# Altium project modFOC.PrjPcb
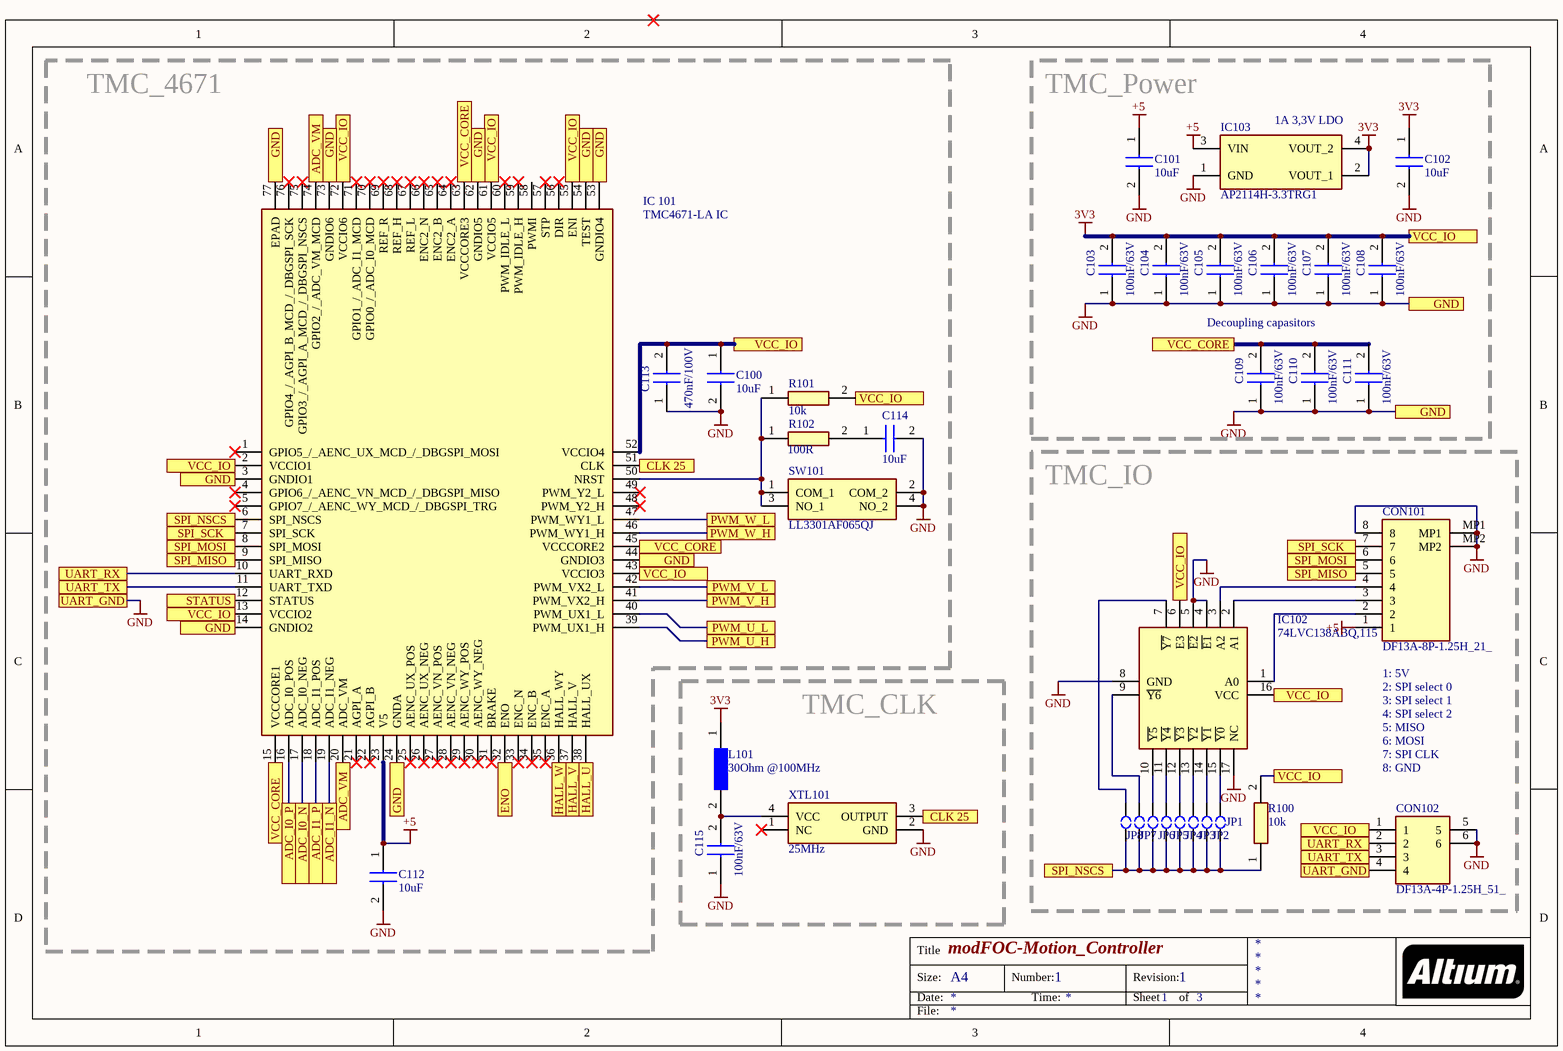
[diagram p0: modFOC-Motion_Controller.SchDoc]
3 sheets, 101 parts. Net scope: flat (ports and power ports of the same name join across sheets).
Board file: modFOC_ESC.PcbDoc
Sheets:
  modFOC-Motion_Controller.SchDoc
  modFOC-Sensing.SchDoc
  modFOC-Powerstage.SchDoc

## Sheet modFOC-Motion_Controller.SchDoc: modFOC-Motion_Controller
size A4; Date: dssd; DocumentNumber: 1; Revision: 1; SheetNumber: 1; SheetTotal: 3

### Parts
C100  10uF  [CAPC3225X280N]
C101  10uF  [CAPC3225X280N]
C102  10uF  [CAPC3225X280N]
C103  100nF/63V  [CAPC1608X97N]
C104  100nF/63V  [CAPC1608X97N]
C105  100nF/63V  [CAPC1608X97N]
C106  100nF/63V  [CAPC1608X97N]
C107  100nF/63V  [CAPC1608X97N]
C108  100nF/63V  [CAPC1608X97N]
C109  100nF/63V  [CAPC1608X97N]
C110  100nF/63V  [CAPC1608X97N]
C111  100nF/63V  [CAPC1608X97N]
C112  10uF  [CAPC3225X280N]
C113  470nF/100V  [CAPC2012X140N]
C114  10uF  [CAPC3225X280N]
C115  100nF/63V  [CAPC1608X97N]
CON101  DF13A-8P-1.25H_21_  [DF13A8P125H21]
CON102  DF13A-4P-1.25H_51_  [DF13A4P125H51]
IC102  74LVC138ABQ,115  [74HCT595BQ115]
IC103  AP2114H-3.3TRG1  [SOT230P700X180-4N]
IC_101  TMC4671-LA IC  [QFN40P1050X650X90-77N]
JP1  SolderJumper  [SolderJmp_0.8mm]  (value not drawn)
JP2  SolderJumper  [SolderJmp_0.8mm]  (value not drawn)
JP3  SolderJumper  [SolderJmp_0.8mm]  (value not drawn)
JP4  SolderJumper  [SolderJmp_0.8mm]  (value not drawn)
JP5  SolderJumper  [SolderJmp_0.8mm]  (value not drawn)
JP6  SolderJumper  [SolderJmp_0.8mm]  (value not drawn)
JP7  SolderJumper  [SolderJmp_0.8mm]  (value not drawn)
JP8  SolderJumper  [SolderJmp_0.8mm]  (value not drawn)
L101  30Ohm @100MHz  [BLM18KG101TH1D]
R100  10k  [RESC1608X55N]
R101  10k  [RESC1608X55N]
R102  100R  [RESC1608X55N]
SW101  LL3301AF065QJ  [LL3301FF065QJ]
XTL101  25MHz  [FOX924B25]

### Blocks framed on the sheet
TMC_4671: C100 C112-C114 IC_101 R101 R102 SW101
TMC_Power: C101-C111 IC103
TMC_IO: CON101 CON102 IC102 JP1-JP8 R100
TMC_CLK: C115 L101 XTL101

### Ports
ADC_I0_N, ADC_I0_P, ADC_I1_N, ADC_I1_P, ADC_VM, CLK 25, ENO, GND, HALL_U, HALL_V, HALL_W, PWM_U_H, PWM_U_L, PWM_V_H, PWM_V_L, PWM_W_H, PWM_W_L, SPI_MISO, SPI_MOSI, SPI_NSCS, SPI_SCK, STATUS, UART_GND, UART_RX, UART_TX, VCC_CORE, VCC_IO

### Nets
3V3: C100.1 C102.1 C103.2 C104.2 C105.2 C106.2 C107.2 C108.2 C113.2 CON102.1 IC102.6(E3) IC102.16(VCC) IC103.2(VOUT_1) IC103.4(VOUT_2) IC_101.2(VCCIO1) IC_101.13(VCCIO2) IC_101.43(VCCIO3) IC_101.52(VCCIO4) IC_101.55(ENI) IC_101.61(VCCIO5) IC_101.72(VCCIO6) L101.1 R100.2 R101.2 ; port VCC_IO
+5: C101.1 C112.1 CON101.1 IC103.3(VIN) IC_101.23(V5)
GND: C100.2 C101.2 C102.2 C103.1 C104.1 C105.1 C106.1 C107.1 C108.1 C109.1 C110.1 C111.1 C112.2 C113.1 C114.2 C115.1 CON101.8 CON101.MP1 CON101.MP2 CON102.4 CON102.5 CON102.6 IC102.4(~{E1}) IC102.5(~{E2}) IC102.8(GND) IC102.17(NC) IC103.1(GND) IC_101.3(GNDIO1) IC_101.14(GNDIO2) IC_101.24(GNDA) IC_101.44(GNDIO3) IC_101.53(GNDIO4) IC_101.54(TEST) IC_101.62(GNDIO5) IC_101.73(GNDIO6) IC_101.77(EPAD) SW101.2(COM_2) SW101.4(NO_2) XTL101.2(GND) ; port GND, port UART_GND
NetC109_2: C109.2 C110.2 C111.2 IC_101.15(VCCCORE1) IC_101.45(VCCCORE2) IC_101.63(VCCCORE3) ; port VCC_CORE
NetC114_1: C114.1 R102.2
NetC115_2: C115.2 L101.2 XTL101.4(VCC)
NetC204_2: IC_101.16(ADC_I0_POS) ; port ADC_I0_P
NetC205_2: IC_101.20(ADC_VM) IC_101.74(GPIO2_/_ADC_VM_MCD) ; port ADC_VM
NetC206_2: IC_101.18(ADC_I1_POS) ; port ADC_I1_P
NetCON101_2: CON101.2 IC102.1(A0)
NetCON101_3: CON101.3 IC102.2(A1)
NetCON101_4: CON101.4 IC102.3(A2)
NetCON101_5: CON101.5 IC_101.9(SPI_MISO) ; port SPI_MISO
NetCON101_6: CON101.6 IC_101.8(SPI_MOSI) ; port SPI_MOSI
NetCON101_7: CON101.7 IC_101.7(SPI_SCK) ; port SPI_SCK
NetCON102_2: CON102.2 IC_101.10(UART_RXD) ; port UART_RX
NetCON102_3: CON102.3 IC_101.11(UART_TXD) ; port UART_TX
NetIC102_7: IC102.7(~{Y7}) JP8.2
NetIC102_9: IC102.9(~{Y6}) JP7.2
NetIC102_10: IC102.10(~{Y5}) JP6.2
NetIC102_11: IC102.11(~{Y4}) JP5.2
NetIC102_12: IC102.12(~{Y3}) JP4.2
NetIC102_13: IC102.13(~{Y2}) JP3.2
NetIC102_14: IC102.14(~{Y1}) JP2.2
NetIC102_15: IC102.15(~{Y0}) JP1.2
NetIC200_2: IC_101.38(HALL_UX) ; port HALL_U
NetIC200_5: IC_101.37(HALL_V) ; port HALL_V
NetIC200_7: IC_101.36(HALL_WY) ; port HALL_W
NetIC300_34: IC_101.46(PWM_WY1_H) ; port PWM_W_H
NetIC300_35: IC_101.47(PWM_WY1_L) ; port PWM_W_L
NetIC300_36: IC_101.41(PWM_VX2_H) ; port PWM_V_H
NetIC300_37: IC_101.42(PWM_VX2_L) ; port PWM_V_L
NetIC300_38: IC_101.39(PWM_UX1_H) ; port PWM_U_H
NetIC300_39: IC_101.40(PWM_UX1_L) ; port PWM_U_L
NetIC_101_6: IC_101.6(SPI_NSCS) JP1.1 JP2.1 JP3.1 JP4.1 JP5.1 JP6.1 JP7.1 JP8.1 R100.1 ; port SPI_NSCS
NetIC_101_12: IC_101.12(STATUS) ; port STATUS
NetIC_101_17: IC_101.17(ADC_I0_NEG) ; port ADC_I0_N
NetIC_101_19: IC_101.19(ADC_I1_NEG) ; port ADC_I1_N
NetIC_101_32: IC_101.32(ENO) ; port ENO
NetIC_101_50: IC_101.50(NRST) R101.1 R102.1 SW101.1(COM_1) SW101.3(NO_1)
NetIC_101_51: IC_101.51(CLK) XTL101.3(OUTPUT) ; port CLK 25

Not connected (* = marked no-connect by the designer): IC_101 1(GPIO5_/_AENC_UX_MCD_/_DBGSPI_MOSI)* 4(GPIO6_/_AENC_VN_MCD_/_DBGSPI_MISO)* 5(GPIO7_/_AENC_WY_MCD_/_DBGSPI_TRG)* 21(AGPI_A)* 22(AGPI_B)* 25(AENC_UX_POS)* 26(AENC_UX_NEG)* 27(AENC_VN_POS)* 28(AENC_VN_NEG)* 29(AENC_WY_POS)* 30(AENC_WY_NEG)* 31(BRAKE)* 33(ENC_N)* 34(ENC_B)* 35(ENC_A)* 48(PWM_Y2_H)* 49(PWM_Y2_L)* 56(DIR)* 57(STP)* 58(PWMI) 59(PWM_IDLE_H)* 60(PWM_IDLE_L)* 64(ENC2_A)* 65(ENC2_B)* 66(ENC2_N)* 67(REF_L)* 68(REF_H)* 69(REF_R)* 70(GPIO0_/_ADC_I0_MCD)* 71(GPIO1_/_ADC_I1_MCD)* 75(GPIO3_/_AGPI_A_MCD_/_DBGSPI_NSCS)* 76(GPIO4_/_AGPI_B_MCD_/_DBGSPI_SCK)*; XTL101 1(NC)*

### Notes on the sheet
- (near IC103) 1A 3,3V LDO
- Decoupling capasitors
- (near CON101) 1: 5V
- 2: SPI select 0
- 3: SPI select 1
- 4: SPI select 2
- 5: MISO
- 6: MOSI
- 7: SPI CLK
- 8: GND
- Title
- Size:
- Date:
- A4
- Number:
- Time:
- Revision:
- Sheet
- of
- File:

### Library data of the parts
C100-C102 C112 C114 = CL32B106KMVNNWE: Capacitor; Manufacturer_Name: Samsung Electro-Mechanics; Datasheet Link: https://www.arrow.com/en/products/cl32b106kmvnnwe/samsung-electro-mechanics; Height: 2.8mm; Manufacturer_Part_Number: CL32B106KMVNNWE; Arrow Part Number: CL32B106KMVNNWE; Arrow Price/Stock: https://www.arrow.com/en/products/cl32b106kmvnnwe/samsung-electro-mechanics; Mouser Part Number: 187-CL32B106KMVNNWE; Mouser Price/Stock: https://www.mouser.co.uk/ProductDetail/Samsung-Electro-Mechanics/CL32B106KMVNNWE?qs=xZ%2FP%252Ba9zWqaEMBbSgKy8gQ%3D%3D
C103-C111 C115 = C0805C104MMREC7210: Capacitor; Manufacturer_Name: Vishay; Manufacturer_Part_Number: VJ0603Y104JXJAC; Datasheet Link: http://www.vishay.com/docs/45226/vj31xrohsautomlcc.pdf; Height: 1mm; Mouser Part Number: 77-VJ0603Y104JXJAC; Mouser Price/Stock: https://www.mouser.com/Search/Refine.aspx?Keyword=77-VJ0603Y104JXJAC
C113 = 08051C474KAT2A: Capacitor; Manufacturer_Name: AVX; Datasheet Link: http://datasheets.avx.com/X7RDielectric.pdf; Height: 1.4mm; Manufacturer_Part_Number: 08051C474KAT2A; Mouser Part Number: 581-08051C474KAT2A; Mouser Price/Stock: https://www.mouser.co.uk/ProductDetail/AVX/08051C474KAT2A?qs=%2FjdEcI0p95Mz%2FN5KbrGN6Q%3D%3D
CON101 = DF13A-8P-1.25H_21_: Connector; Manufacturer_Name: Hirose; Manufacturer_Part_Number: DF13A-8P-1.25H(21); Datasheet Link: http://uk.rs-online.com/web/p/products/7793617P; Height: 3.6mm; Mouser Part Number: 798-DF13A8P125H21; Mouser Price/Stock: https://www.mouser.co.uk/ProductDetail/Hirose-Connector/DF13A-8P-125H21?qs=XQjbzJWzFPViW0MGk5%2FVbA%3D%3D
CON102 = DF13A-4P-1.25H_51_: Connector; Manufacturer_Name: Hirose; Manufacturer_Part_Number: DF13A-4P-1.25H(51); Datasheet Link: https://www.hirose.com/product/en/products/DF13/DF13A-4P-1.25H%2851%29/; Height: 3mm; Mouser Part Number: 798-DF13A4P125H51; Mouser Price/Stock: https://www.mouser.co.uk/ProductDetail/Hirose-Connector/DF13A-4P-125H51?qs=XQjbzJWzFPVR%252B%2FH2vthd9w%3D%3D
IC102 = 74LVC138ABQ,115: Integrated Circuit; Manufacturer_Name: Nexperia; Datasheet Link: https://assets.nexperia.com/documents/data-sheet/74LVC138A.pdf; Manufacturer_Part_Number: 74LVC138ABQ,115; Arrow Part Number: 74LVC138ABQ,115; Arrow Price/Stock: https://www.arrow.com/en/products/74lvc138abq115/nexperia; Mouser Part Number: 771-LVC138ABQ115; Mouser Price/Stock: https://www.mouser.co.uk/ProductDetail/Nexperia/74LVC138ABQ115?qs=me8TqzrmIYUqHGpwzmLq4w%3D%3D
IC103 = AP2114H-3.3TRG1: Integrated Circuit; Manufacturer_Name: Diodes Inc.; Datasheet Link: http://uk.rs-online.com/web/p/products/8283528; Height: 1.8mm; Manufacturer_Part_Number: AP2114H-3.3TRG1; Arrow Part Number: AP2114H-3.3TRG1; Arrow Price/Stock: https://www.arrow.com/en/products/ap2114h-3.3trg1/diodes-incorporated; Mouser Part Number: 621-AP2114H-3.3TRG1; Mouser Price/Stock: https://www.mouser.co.uk/ProductDetail/Diodes-Incorporated/AP2114H-33TRG1?qs=x6A8l6qLYDDSG%2FfwzcsOhw%3D%3D
IC_101 = TMC4671-LA IC: Integrated Circuit
L101 = BLM18KG300TH1D: Ferrite Bead; Manufacturer_Name: Murata Electronics; Datasheet Link: https://www.murata.com/en-us/products/productdetail?partno=BLM18KG300TH1%23; Height: 0.75mm; Manufacturer_Part_Number: BLM18KG300TH1D; Arrow Part Number: BLM18KG300TH1D; Arrow Price/Stock: https://www.arrow.com/en/products/blm18kg300th1d/murata-manufacturing; Mouser Part Number: 81-BLM18KG300TH1D; Mouser Price/Stock: https://www.mouser.com/Search/Refine.aspx?Keyword=81-BLM18KG300TH1D
R100 R101 = RC0603FR-0710KL: Resistor; Manufacturer_Name: YAGEO (PHYCOMP); Datasheet Link: http://www.yageo.com/documents/recent/PYu-RC0603_51_RoHS_L_v5.pdf; Height: 0.55mm; Manufacturer_Part_Number: RC0603FR-0710KL; Arrow Part Number: RC0603FR-0710KL; Arrow Price/Stock: https://www.arrow.com/en/products/rc0603fr-0710kl/yageo; Mouser Part Number: 603-RC0603FR-0710KL; Mouser Price/Stock: https://www.mouser.co.uk/ProductDetail/Yageo/RC0603FR-0710KL?qs=grNVn54RoB%252B3GtjbJj3wJQ%3D%3D
R102 = CRCW0603100RFKEAC: Resistor; Manufacturer_Name: Vishay; Datasheet Link: https://componentsearchengine.com/Datasheets/1/CRCW0603100RFKEAC.pdf; Height: 0.55mm; Manufacturer_Part_Number: CRCW0603100RFKEAC; Mouser Part Number: 71-CRCW0603100RFKEAC; Mouser Price/Stock: https://www.mouser.co.uk/ProductDetail/Vishay-Dale/CRCW0603100RFKEAC/?qs=E3Y5ESvWgWPJqb4%2F19sAKw%3D%3D; Arrow Part Number: CRCW0603100RFKEAC; Arrow Price/Stock: https://www.arrow.com/en/products/crcw0603100rfkeac/vishay
SW101 = LL3301AF065QJ: Switch; Manufacturer_Name: E-Switch; Datasheet Link: https://media.digikey.com/pdf/Data%20Sheets/E-Switch%20PDFs/LL3301AF065QJ.pdf; Height: 7.3mm; Manufacturer_Part_Number: LL3301AF065QJ; Mouser Part Number: 612-LL3301AF065QJ; Mouser Price/Stock: https://www.mouser.co.uk/ProductDetail/E-Switch/LL3301AF065QJ?qs=QtyuwXswaQi68RkbBY57jQ%3D%3D
XTL101 = FOX924B-25: 25Mhz Oscillator

## Sheet modFOC-Sensing.SchDoc
size A4; DocumentNumber: 2; SheetNumber: 2; SheetTotal: 3
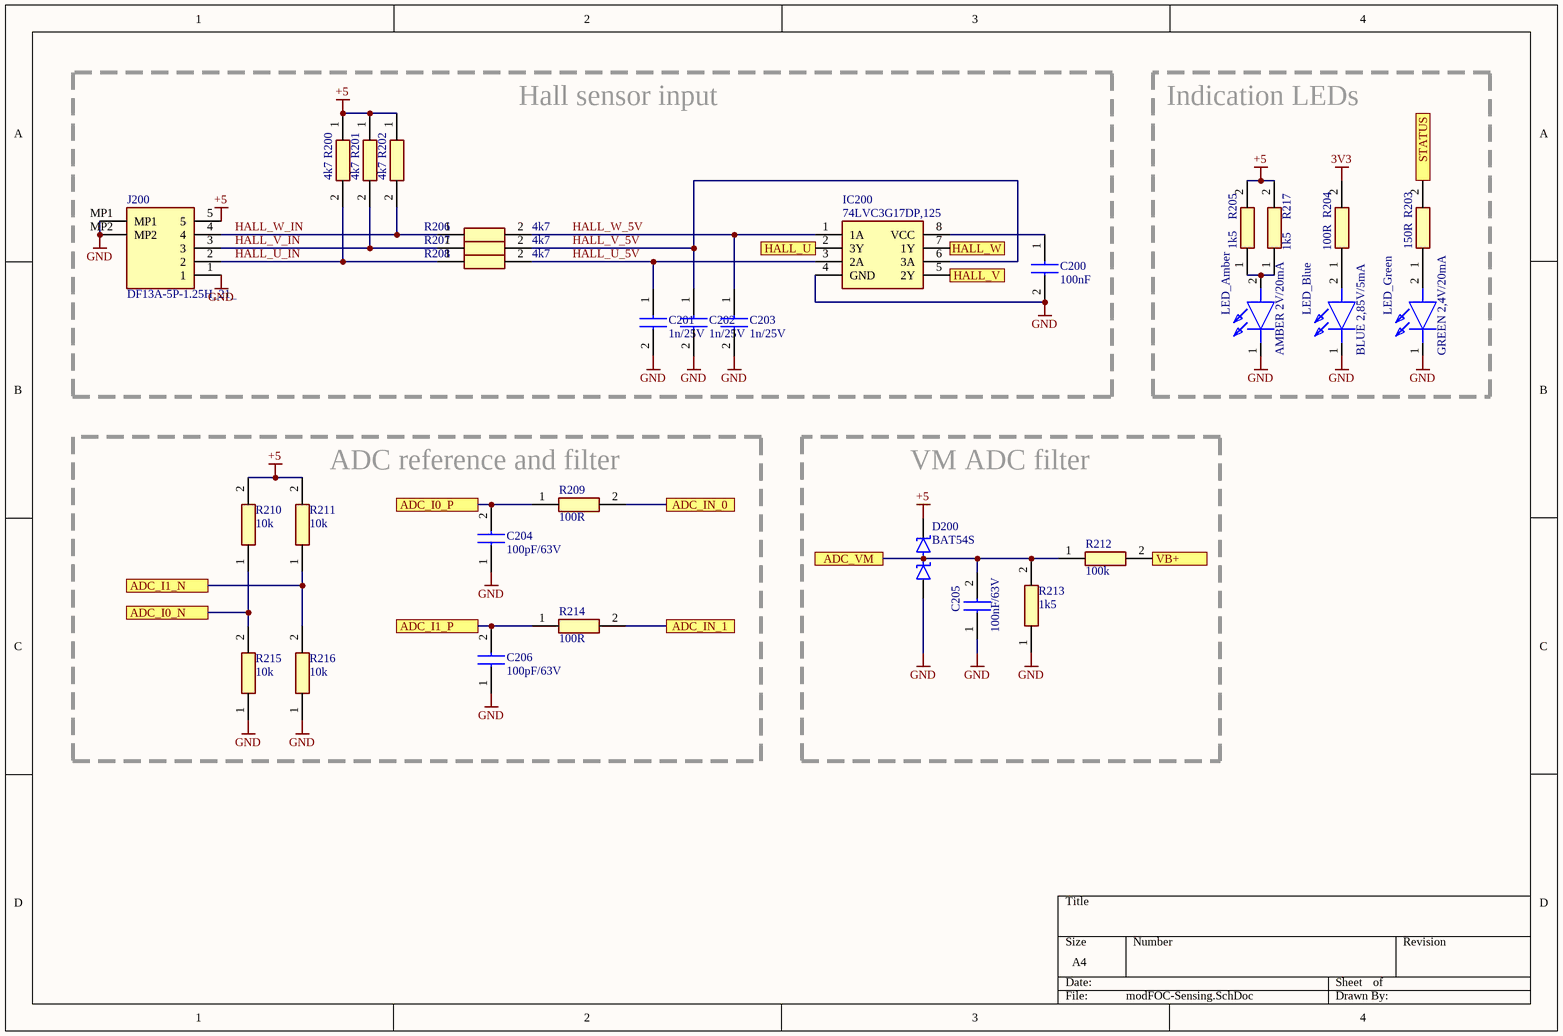
[diagram p1: modFOC-Sensing.SchDoc]

### Parts
C200  100nF  [CAPC1608X97N]
C201  1n/25V  [CAPC1608X97N]
C202  1n/25V  [CAPC1608X97N]
C203  1n/25V  [CAPC1608X97N]
C204  100pF/63V  [CAPC1608X87N]
C205  100nF/63V  [CAPC1608X97N]
C206  100pF/63V  [CAPC1608X87N]
D200  BAT54S  [SOT95P240X110-3N]
IC200  74LVC3G17DP,125  [SOP65P400X110-8N]
J200  DF13A-5P-1.25H_21_  [DF13A5P125H21]
LED_Amber  AMBER 2V/20mA  [LEDC1608X55N]
LED_Blue  BLUE 2,85V/5mA  [LEDC1608X40N]
LED_Green  GREEN 2,4V/20mA  [LGQ396PS35]
R200  4k7  [RESC1608X55N]
R201  4k7  [RESC1608X55N]
R202  4k7  [RESC1608X55N]
R203  150R  [RESC1608X55N]
R204  100R  [RESC1608X55N]
R205  1k5  [RESC1608X55N]
R206  4k7  [RESC1608X55N]
R207  4k7  [RESC1608X55N]
R208  4k7  [RESC1608X55N]
R209  100R  [RESC1608X55N]
R210  10k  [RESC1608X55N]
R211  10k  [RESC1608X55N]
R212  100k  [RESC1608X55N]
R213  1k5  [RESC1608X55N]
R214  100R  [RESC1608X55N]
R215  10k  [RESC1608X55N]
R216  10k  [RESC1608X55N]
R217  1k5  [RESC1608X55N]

### Blocks framed on the sheet
Hall sensor input: C200-C203 IC200 J200 R200-R202 R206-R208
Indication LEDs: LED_Amber LED_Blue LED_Green R203-R205 R217
ADC reference and filter: C204 C206 R209-R211 R214-R216
VM ADC filter: C205 D200 R212 R213

### Ports
ADC_I0_N, ADC_I0_P, ADC_I1_N, ADC_I1_P, ADC_IN_0, ADC_IN_1, ADC_VM, HALL_U, HALL_V, HALL_W, STATUS, VB+

### Nets
3V3: R204.2
+5: D200.2(K) J200.5 R200.1 R201.1 R202.1 R205.2 R210.2 R211.2 R217.2
GND: C200.2 C201.2 C202.2 C203.2 C204.1 C205.1 C206.1 D200.1(A) IC200.4(GND) J200.1 J200.MP1 J200.MP2 LED_Amber.1(K) LED_Blue.1(K) LED_Green.1(K) R213.1 R215.1 R216.1
VB+: R212.2 ; port VB+
HALL_U_5V: C201.1 IC200.3(2A) R208.2
HALL_U_IN: J200.2 R200.2 R208.1
HALL_V_5V: C202.1 IC200.6(3A) R207.2
HALL_V_IN: J200.3 R201.2 R207.1
HALL_W_5V: C203.1 IC200.1(1A) R206.2
HALL_W_IN: J200.4 R202.2 R206.1
NetC200_1: C200.1 IC200.8(VCC)
NetC204_2: C204.2 R209.1 ; port ADC_I0_P
NetC205_2: C205.2 D200.3(A/K) R212.1 R213.2 ; port ADC_VM
NetC206_2: C206.2 R214.1 ; port ADC_I1_P
NetIC200_2: IC200.2(3Y) ; port HALL_U
NetIC200_5: IC200.5(2Y) ; port HALL_V
NetIC200_7: IC200.7(1Y) ; port HALL_W
NetIC300_22: R214.2 ; port ADC_IN_1
NetIC300_23: R209.2 ; port ADC_IN_0
NetIC_101_12: R203.2 ; port STATUS
NetIC_101_17: R210.1 R215.2 ; port ADC_I0_N
NetIC_101_19: R211.1 R216.2 ; port ADC_I1_N
NetLED_Amber_2: LED_Amber.2(A) R205.1 R217.1
NetLED_Blue_2: LED_Blue.2(A) R204.1
NetLED_Green_2: LED_Green.2(A) R203.1

### Library data of the parts
C200 = VJ0603Y104JXJAC: Capacitor; Manufacturer_Name: Vishay; Datasheet Link: http://www.vishay.com/docs/45226/vj31xrohsautomlcc.pdf; Height: 0.97mm; Manufacturer_Part_Number: VJ0603Y104JXJAC; Mouser Part Number: 77-VJ0603Y104JXJAC; Mouser Price/Stock: https://www.mouser.com/Search/Refine.aspx?Keyword=77-VJ0603Y104JXJAC
C201-C203 = GRM033R71E102KA01D: Capacitor; Manufacturer_Name: Murata Electronics; Datasheet Link: https://psearch.en.murata.com/capacitor/product/GRM033R71E102KA01%23.html; Height: 0.33mm; Manufacturer_Part_Number: GRM033R71E102KA01D; Mouser Part Number: 81-GRM033R71E102KA1D; Mouser Price/Stock: https://www.mouser.co.uk/ProductDetail/Murata-Electronics/GRM033R71E102KA01D/?qs=%252BwCMEOx2S5vqymn%2Fc34U1A%3D%3D; Arrow Part Number: GRM033R71E102KA01D; Arrow Price/Stock: https://www.arrow.com/en/products/grm033r71e102ka01d/murata-manufacturing
C204 C206 = C0603C101K1HACTU: Capacitor; Manufacturer_Name: Kemet; Datasheet Link: https://www.mouser.com/datasheet/2/212/KEM_C1007_X8R_ULTRA_150C_SMD-1102703.pdf; Height: 0.87mm; Manufacturer_Part_Number: C0603C101K1HACTU; Mouser Part Number: 80-C0603C101K1HACTU; Mouser Price/Stock: https://www.mouser.co.uk/ProductDetail/KEMET/C0603C101K1HACTU?qs=W0yvOO0ixfE5G01qpfeqIQ%3D%3D
C205 = C0805C104MMREC7210: as C103 on sheet modFOC-Motion_Controller; Datasheet Link: http://www.vishay.com/docs/45226/vj31xrohsautomlcc.pdf; Height: 1mm; Mouser Part Number: 77-VJ0603Y104JXJAC; Mouser Price/Stock: https://www.mouser.com/Search/Refine.aspx?Keyword=77-VJ0603Y104JXJAC
D200 = BAT54S: Schottky Diode; Manufacturer_Name: Rectron; Datasheet Link: https://www.rectron.com/data_sheets/bat54s.pdf; Height: 1.1mm; Manufacturer_Part_Number: BAT54S; Mouser Part Number: 583-BAT54S; Mouser Price/Stock: https://www.mouser.co.uk/ProductDetail/Rectron/BAT54S?qs=7pEAo90IqNGRiqD7TkybWA%3D%3D; Arrow Part Number: BAT54S; Arrow Price/Stock: https://www.arrow.com/en/products/bat54s/rectron
IC200 = 74LVC3G17DP,125: Integrated Circuit; Manufacturer_Name: Nexperia; Datasheet Link: https://assets.nexperia.com/documents/data-sheet/74LVC3G17.pdf; Height: 1.1mm; Manufacturer_Part_Number: 74LVC3G17DP,125; Mouser Part Number: 771-LVC3G17DP125; Mouser Price/Stock: https://www.mouser.co.uk/ProductDetail/Nexperia/74LVC3G17DP125?qs=me8TqzrmIYUUngWcw0uHGA%3D%3D; Arrow Part Number: 74LVC3G17DP,125; Arrow Price/Stock: https://www.arrow.com/en/products/74lvc3g17dp125/nexperia
J200 = DF13A-5P-1.25H_21_: Connector; Manufacturer_Name: Hirose; Manufacturer_Part_Number: DF13A-5P-1.25H(21); Datasheet Link: https://componentsearchengine.com/Datasheets/1/DF13A-5P-1.25H(21).pdf; Height: 3.75mm; Mouser Part Number: 798-DF13A5P125H21; Mouser Price/Stock: https://www.mouser.co.uk/ProductDetail/Hirose-Connector/DF13A-5P-125H21?qs=XQjbzJWzFPWvJsE2o%252B4Q8Q%3D%3D
LED_Amber = ASMT-RA45-AP932: LED; Manufacturer_Name: Avago Technologies; Datasheet Link: https://docs.broadcom.com/docs/AV02-0378EN; Height: 0.55mm; Manufacturer_Part_Number: ASMT-RA45-AP932; Mouser Part Number: 630-ASMT-RA45-AP932; Mouser Price/Stock: https://www.mouser.co.uk/ProductDetail/Broadcom-Avago/ASMT-RA45-AP932?qs=7zQgkplsu%2FO5gZneoB42ug%3D%3D
LED_Blue = LB_Q39G-L2OO-35-1: LED; Manufacturer_Name: OSRAM; Manufacturer_Part_Number: LB Q39G-L2OO-35-1; Datasheet Link: http://www.mouser.com/ds/2/311/LB Q39G - CHIPLED 0603-553388.pdf; Height: 0.4mm; Mouser Part Number: 720-LBQ39GL2N2351; Mouser Price/Stock: https://www.mouser.co.uk/ProductDetail/OSRAM-Opto-Semiconductors/LB-Q39G-L2OO-35-1?qs=74fRo9GAWsxvZBH6a5xY%252BA%3D%3D; Arrow Part Number: LB Q39G-L2OO-35-1; Arrow Price/Stock: https://www.arrow.com/en/products/lbq39g-l2oo-35-1/osram-opto-semiconductors
LED_Green = LG_Q396-PS-35: LED; Manufacturer_Name: OSRAM; Manufacturer_Part_Number: LG Q396-PS-35; Datasheet Link: https://mouser.componentsearchengine.com/Datasheets/2/LG%20Q396-PS-35.pdf; Height: 0.4mm; Mouser Part Number: 720-LGQ396A3964; Mouser Price/Stock: https://www.mouser.co.uk/ProductDetail/OSRAM-Opto-Semiconductors/LG-Q396-PS-35?qs=xC%252BE9h5iuX5%252BCocujXxOpw%3D%3D; Arrow Part Number: LG Q396-PS-35; Arrow Price/Stock: https://www.arrow.com/en/products/lgq396-ps-35/osram-opto-semiconductors
R200-R202 R206-R208 = CRCW06034K70JNEAC: Resistor; Manufacturer_Name: Vishay; Datasheet Link: http://www.vishay.com/docs/28773/crcwce3.pdf; Height: 0.55mm; Manufacturer_Part_Number: CRCW06034K70JNEAC; Mouser Part Number: 71-CRCW06034K70JNEAC; Mouser Price/Stock: https://www.mouser.co.uk/ProductDetail/Vishay-Dale/CRCW06034K70JNEAC/?qs=E3Y5ESvWgWMzBuUf0K3dnA%3D%3D; Arrow Part Number: CRCW06034K70JNEAC; Arrow Price/Stock: https://www.arrow.com/en/products/crcw06034k70jneac/vishay
R203 = SFR03EZPF1500: Resistor; Manufacturer_Name: ROHM Semiconductor; Datasheet Link: https://componentsearchengine.com/Datasheets/1/SFR03EZPF1500.pdf; Height: 0.55mm; Manufacturer_Part_Number: SFR03EZPF1500; Mouser Part Number: 755-SFR03EZPF1500; Mouser Price/Stock: https://www.mouser.com/Search/Refine.aspx?Keyword=755-SFR03EZPF1500
R204 R209 R214 = CRCW0603100RFKEAC: Resistor; Manufacturer_Name: Vishay; Datasheet Link: https://componentsearchengine.com/Datasheets/1/CRCW0603100RFKEAC.pdf; Height: 0.55mm; Manufacturer_Part_Number: CRCW0603100RFKEAC; Mouser Part Number: 71-CRCW0603100RFKEAC; Mouser Price/Stock: https://www.mouser.co.uk/ProductDetail/Vishay-Dale/CRCW0603100RFKEAC/?qs=E3Y5ESvWgWPJqb4%2F19sAKw%3D%3D; Arrow Part Number: CRCW0603100RFKEAC; Arrow Price/Stock: https://www.arrow.com/en/products/crcw0603100rfkeac/vishay
R205 R213 R217 = ERJ1GNF1501C: Resistor; Manufacturer_Name: Panasonic; Datasheet Link: https://industrial.panasonic.com/cdbs/www-data/pdf/RDA0000/AOA0000C84.pdf; Height: 0.26mm; Manufacturer_Part_Number: ERJ1GNF1501C
R210 R211 R215 R216 = RC0603FR-0710KL: as R100 on sheet modFOC-Motion_Controller; Datasheet Link: http://www.yageo.com/documents/recent/PYu-RC0603_51_RoHS_L_v5.pdf; Height: 0.55mm; Manufacturer_Part_Number: RC0603FR-0710KL; Arrow Part Number: RC0603FR-0710KL; Arrow Price/Stock: https://www.arrow.com/en/products/rc0603fr-0710kl/yageo; Mouser Part Number: 603-RC0603FR-0710KL; Mouser Price/Stock: https://www.mouser.co.uk/ProductDetail/Yageo/RC0603FR-0710KL?qs=grNVn54RoB%252B3GtjbJj3wJQ%3D%3D
R212 = ERJ1GNF1003C: Resistor; Manufacturer_Name: Panasonic; Datasheet Link: https://industrial.panasonic.com/cdbs/www-data/pdf/RDA0000/AOA0000C84.pdf; Height: 0.26mm; Manufacturer_Part_Number: ERJ1GNF1003C; Arrow Part Number: ERJ1GNF1003C; Arrow Price/Stock: https://www.arrow.com/en/products/erj1gnf1003c/panasonic

## Sheet modFOC-Powerstage.SchDoc
size A4; SheetNumber: 3; SheetTotal: 3
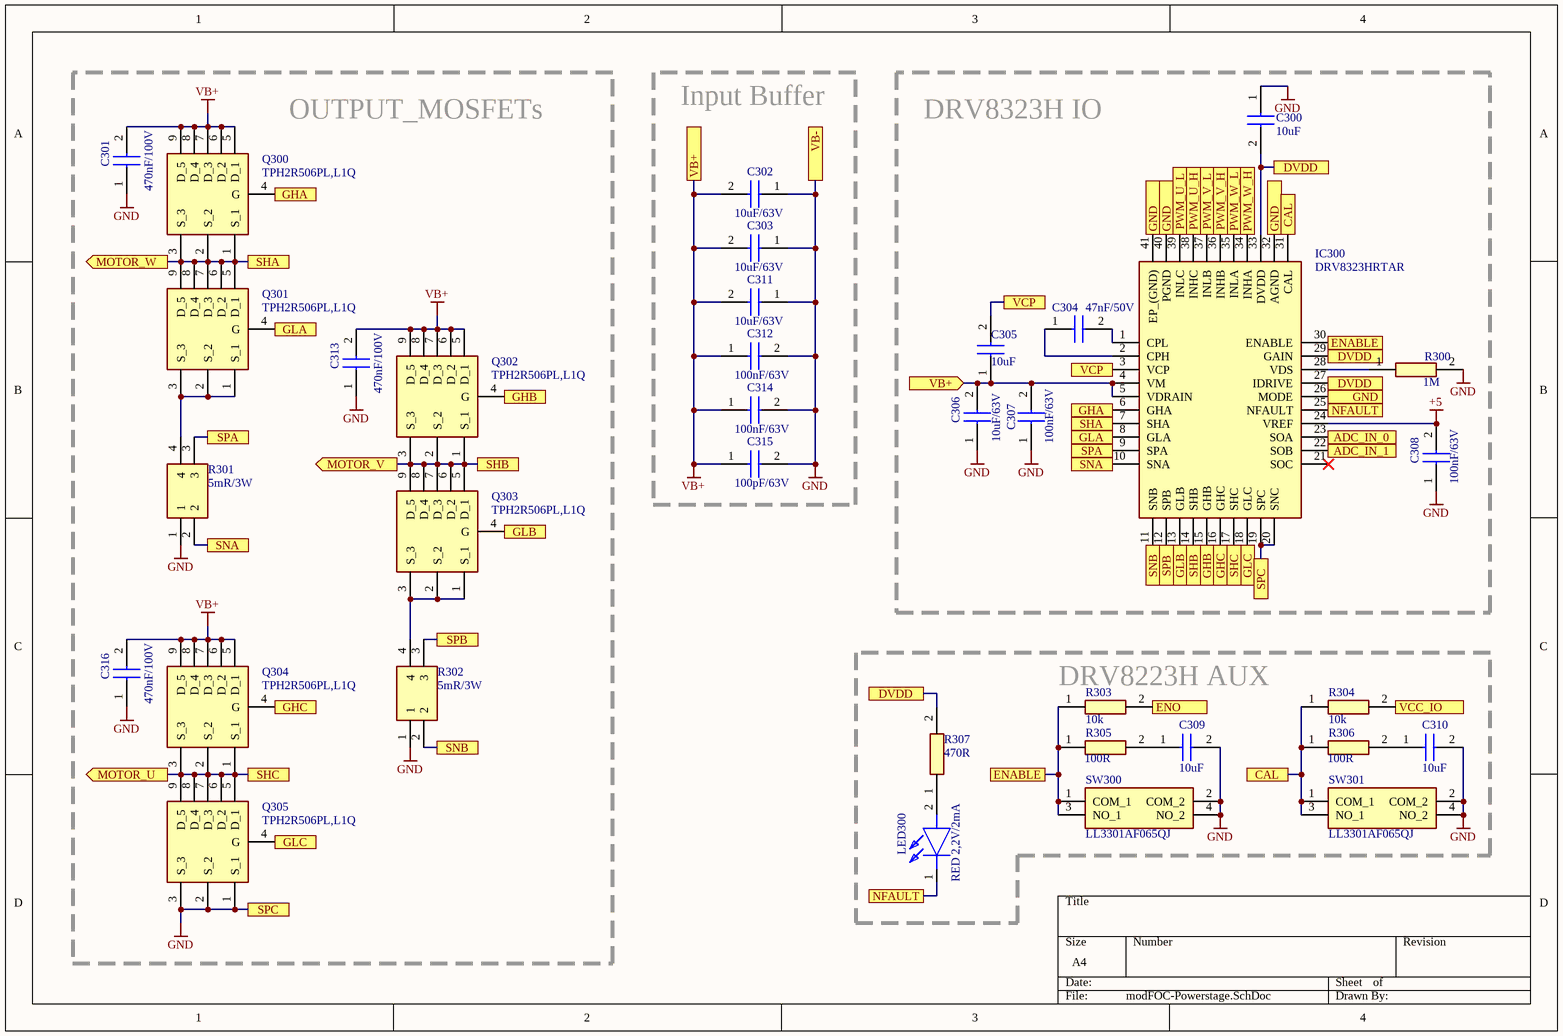
[diagram p2: modFOC-Powerstage.SchDoc]

### Parts
C300  10uF  [CAPC3225X280N]
C301  470nF/100V  [CAPC2012X140N]
C302  10uF/63V  [CAPC3225X280N]
C303  10uF/63V  [CAPC3225X280N]
C304  47nF/50V  [CAPC1608X90N]
C305  10uF  [CAPC3225X280N]
C306  10uF/63V  [CAPC3225X280N]
C307  100nF/63V  [CAPC1608X97N]
C308  100nF/63V  [CAPC1608X97N]
C309  10uF  [CAPC3225X280N]
C310  10uF  [CAPC3225X280N]
C311  10uF/63V  [CAPC3225X280N]
C312  100nF/63V  [CAPC1608X97N]
C313  470nF/100V  [CAPC2012X140N]
C314  100nF/63V  [CAPC1608X97N]
C315  100pF/63V  [CAPC1608X87N]
C316  470nF/100V  [CAPC2012X140N]
IC300  DRV8323HRTAR  [QFN50P600X600X80-41N-D]
LED300  RED 2,2V/2mA  [LSL29KG1J21Z]
Q300  TPH2R506PL,L1Q  [TPHR9003NLL1Q]
Q301  TPH2R506PL,L1Q  [TPHR9003NLL1Q]
Q302  TPH2R506PL,L1Q  [TPHR9003NLL1Q]
Q303  TPH2R506PL,L1Q  [TPHR9003NLL1Q]
Q304  TPH2R506PL,L1Q  [TPHR9003NLL1Q]
Q305  TPH2R506PL,L1Q  [TPHR9003NLL1Q]
R300  1M  [RESC1608X55N]
R301  5mR/3W  [WSK12161L000FEA]
R302  5mR/3W  [WSK12161L000FEA]
R303  10k  [RESC1608X55N]
R304  10k  [RESC1608X55N]
R305  100R  [RESC1608X55N]
R306  100R  [RESC1608X55N]
R307  470R  [RESC1608X55N]
SW300  LL3301AF065QJ  [LL3301FF065QJ]
SW301  LL3301AF065QJ  [LL3301FF065QJ]

### Blocks framed on the sheet
OUTPUT_MOSFETs: C301 C313 C316 Q300-Q305 R301 R302
Input Buffer: C302 C303 C311 C312 C314 C315
DRV8323H IO: C300 C304-C308 IC300 R300
DRV8223H AUX: C309 C310 LED300 R303-R307 SW300 SW301

### Ports
ADC_IN_0, ADC_IN_1, CAL, DVDD, ENABLE, ENO, GHA, GHB, GHC, GLA, GLB, GLC, GND, MOTOR_U (out), MOTOR_V (out), MOTOR_W (out), NFAULT, PWM_U_H, PWM_U_L, PWM_V_H, PWM_V_L, PWM_W_H, PWM_W_L, SHA, SHB, SHC, SNA, SNB, SPA, SPB, SPC, VB+, VB+ (in), VB-, VCC_IO, VCP

### Nets
3V3: R304.2 ; port VCC_IO
+5: C308.2 IC300.24(VREF)
GND: C300.1 C301.1 C302.1 C303.1 C306.1 C307.1 C308.1 C309.2 C310.2 C311.1 C312.2 C313.1 C314.2 C315.2 C316.1 IC300.19(SPC) IC300.20(SNC) IC300.26(MODE) IC300.32(AGND) IC300.40(PGND) IC300.41(EP_(GND)) Q305.1(S_1) Q305.2(S_2) Q305.3(S_3) R300.2 R301.1 R302.1 SW300.2(COM_2) SW300.4(NO_2) SW301.2(COM_2) SW301.4(NO_2) ; port GND, port SPC, port VB-
VB+: C301.2 C302.2 C303.2 C305.1 C306.2 C307.2 C311.2 C312.1 C313.2 C314.1 C315.1 C316.2 IC300.4(VM) IC300.5(VDRAIN) Q300.5(D_1) Q300.6(D_2) Q300.7(D_3) Q300.8(D_4) Q300.9(D_5) Q302.5(D_1) Q302.6(D_2) Q302.7(D_3) Q302.8(D_4) Q302.9(D_5) Q304.5(D_1) Q304.6(D_2) Q304.7(D_3) Q304.8(D_4) Q304.9(D_5) ; port VB+
NetC300_2: C300.2 IC300.27(IDRIVE) IC300.29(GAIN) IC300.33(DVDD) R307.2 ; port DVDD
NetC304_1: C304.1 IC300.2(CPH)
NetC304_2: C304.2 IC300.1(CPL)
NetC305_2: C305.2 IC300.3(VCP) ; port VCP
NetC309_1: C309.1 R305.2
NetC310_1: C310.1 R306.2
NetIC300_6: IC300.6(GHA) Q300.4(G) ; port GHA
NetIC300_7: IC300.7(SHA) Q300.1(S_1) Q300.2(S_2) Q300.3(S_3) Q301.5(D_1) Q301.6(D_2) Q301.7(D_3) Q301.8(D_4) Q301.9(D_5) ; port SHA, port MOTOR_W
NetIC300_8: IC300.8(GLA) Q301.4(G) ; port GLA
NetIC300_9: IC300.9(SPA) R301.3 ; port SPA
NetIC300_10: IC300.10(SNA) R301.2 ; port SNA
NetIC300_11: IC300.11(SNB) R302.2 ; port SNB
NetIC300_12: IC300.12(SPB) R302.3 ; port SPB
NetIC300_13: IC300.13(GLB) Q303.4(G) ; port GLB
NetIC300_14: IC300.14(SHB) Q302.1(S_1) Q302.2(S_2) Q302.3(S_3) Q303.5(D_1) Q303.6(D_2) Q303.7(D_3) Q303.8(D_4) Q303.9(D_5) ; port SHB, port MOTOR_V
NetIC300_15: IC300.15(GHB) Q302.4(G) ; port GHB
NetIC300_16: IC300.16(GHC) Q304.4(G) ; port GHC
NetIC300_17: IC300.17(SHC) Q304.1(S_1) Q304.2(S_2) Q304.3(S_3) Q305.5(D_1) Q305.6(D_2) Q305.7(D_3) Q305.8(D_4) Q305.9(D_5) ; port SHC, port MOTOR_U
NetIC300_18: IC300.18(GLC) Q305.4(G) ; port GLC
NetIC300_22: IC300.22(SOB) ; port ADC_IN_1
NetIC300_23: IC300.23(SOA) ; port ADC_IN_0
NetIC300_25: IC300.25(NFAULT) LED300.1(K) ; port NFAULT
NetIC300_28: IC300.28(VDS) R300.1
NetIC300_30: IC300.30(ENABLE) R303.1 R305.1 SW300.1(COM_1) SW300.3(NO_1) ; port ENABLE
NetIC300_31: IC300.31(CAL) R304.1 R306.1 SW301.1(COM_1) SW301.3(NO_1) ; port CAL
NetIC300_34: IC300.34(INHA) ; port PWM_W_H
NetIC300_35: IC300.35(INLA) ; port PWM_W_L
NetIC300_36: IC300.36(INHB) ; port PWM_V_H
NetIC300_37: IC300.37(INLB) ; port PWM_V_L
NetIC300_38: IC300.38(INHC) ; port PWM_U_H
NetIC300_39: IC300.39(INLC) ; port PWM_U_L
NetIC_101_32: R303.2 ; port ENO
NetLED300_2: LED300.2(A) R307.1
NetQ301_1: Q301.1(S_1) Q301.2(S_2) Q301.3(S_3) R301.4
NetQ303_1: Q303.1(S_1) Q303.2(S_2) Q303.3(S_3) R302.4

Not connected (* = marked no-connect by the designer): IC300 21(SOC)*

### Library data of the parts
C300 C302 C303 C305 C306 C309-C311 = CL32B106KMVNNWE: as C100 on sheet modFOC-Motion_Controller; Datasheet Link: https://www.arrow.com/en/products/cl32b106kmvnnwe/samsung-electro-mechanics; Height: 2.8mm; Manufacturer_Part_Number: CL32B106KMVNNWE; Arrow Part Number: CL32B106KMVNNWE; Arrow Price/Stock: https://www.arrow.com/en/products/cl32b106kmvnnwe/samsung-electro-mechanics; Mouser Part Number: 187-CL32B106KMVNNWE; Mouser Price/Stock: https://www.mouser.co.uk/ProductDetail/Samsung-Electro-Mechanics/CL32B106KMVNNWE?qs=xZ%2FP%252Ba9zWqaEMBbSgKy8gQ%3D%3D
C301 C313 C316 = 08051C474KAT2A: Capacitor; Manufacturer_Name: AVX; Datasheet Link: http://datasheets.avx.com/X7RDielectric.pdf; Height: 1.4mm; Manufacturer_Part_Number: 08051C474KAT2A; Mouser Part Number: 581-08051C474KAT2A; Mouser Price/Stock: https://www.mouser.co.uk/ProductDetail/AVX/08051C474KAT2A?qs=%2FjdEcI0p95Mz%2FN5KbrGN6Q%3D%3D
C304 = CGA3E2X7R1H473K080AA: Capacitor; Manufacturer_Name: TDK; Datasheet Link: http://docs-emea.rs-online.com/webdocs/14e9/0900766b814e9125.pdf; Height: 0.9mm; Manufacturer_Part_Number: CGA3E2X7R1H473K080AA; Mouser Part Number: 810-CGA3E2X7R1H473K; Mouser Price/Stock: https://www.mouser.co.uk/ProductDetail/TDK/CGA3E2X7R1H473K080AA?qs=NRhsANhppD%252BXNlr9LoLgTw%3D%3D; Arrow Part Number: CGA3E2X7R1H473K080AA; Arrow Price/Stock: https://www.arrow.com/en/products/cga3e2x7r1h473k080aa/tdk
C307 C308 C312 C314 = C0805C104MMREC7210: as C103 on sheet modFOC-Motion_Controller; Datasheet Link: http://www.vishay.com/docs/45226/vj31xrohsautomlcc.pdf; Height: 1mm; Mouser Part Number: 77-VJ0603Y104JXJAC; Mouser Price/Stock: https://www.mouser.com/Search/Refine.aspx?Keyword=77-VJ0603Y104JXJAC
C315 = C0603C101K1HACTU: Capacitor; Manufacturer_Name: Kemet; Datasheet Link: https://www.mouser.com/datasheet/2/212/KEM_C1007_X8R_ULTRA_150C_SMD-1102703.pdf; Height: 0.87mm; Manufacturer_Part_Number: C0603C101K1HACTU; Mouser Part Number: 80-C0603C101K1HACTU; Mouser Price/Stock: https://www.mouser.co.uk/ProductDetail/KEMET/C0603C101K1HACTU?qs=W0yvOO0ixfE5G01qpfeqIQ%3D%3D
IC300 = DRV8323HRTAR: Integrated Circuit; Manufacturer_Name: Texas Instruments; Datasheet Link: http://www.ti.com/lit/gpn/drv8323; Height: 0.8mm; Manufacturer_Part_Number: DRV8323HRTAR; Mouser Part Number: 595-DRV8323HRTAR; Mouser Price/Stock: https://www.mouser.co.uk/ProductDetail/Texas-Instruments/DRV8323HRTAR?qs=u4fy%2FsgLU9N%252BsI8bz2iwaQ%3D%3D; Arrow Part Number: DRV8323HRTAR; Arrow Price/Stock: https://www.arrow.com/en/products/drv8323hrtar/texas-instruments
LED300 = LS_L29K-G1J2-1-Z: LED; Manufacturer_Name: OSRAM; Manufacturer_Part_Number: LS L29K-G1J2-1-Z; Datasheet Link: https://dammedia.osram.info/media/resource/hires/osram-dam-5662679/LS%20L29K_EN.pdf; Height: 0.67mm; Mouser Part Number: 720-LSL29K-G1J2-1-Z; Mouser Price/Stock: https://www.mouser.co.uk/ProductDetail/OSRAM-Opto-Semiconductors/LS-L29K-G1J2-1-Z?qs=nTDll3UaDK6mUW9LNPY0Mw%3D%3D
Q300-Q305 = TPH2R506PL,L1Q: MOSFET (N-Channel); Manufacturer_Name: Toshiba; Datasheet Link: http://toshiba.semicon-storage.com/info/docget.jsp?did=55522&prodName=TPH2R506PL; Height: 1mm; Manufacturer_Part_Number: TPH2R506PL,L1Q; Mouser Part Number: 757-TPH2R506PLL1Q; Mouser Price/Stock: https://www.mouser.co.uk/ProductDetail/Toshiba/TPH2R506PLL1Q?qs=bUPhaerQQeFGJjj6SxbPEQ%3D%3D; Arrow Part Number: TPH2R506PL,L1Q; Arrow Price/Stock: https://www.arrow.com/en/products/tph2r506pll1q/toshiba
R300 = RC0603FR-071ML: Resistor; Manufacturer_Name: YAGEO (PHYCOMP); Datasheet Link: https://www.yageo.com/upload/media/product/productsearch/datasheet/rchip/PYu-RC_Group_51_RoHS_L_11.pdf; Height: 0.55mm; Manufacturer_Part_Number: RC0603FR-071ML; Mouser Part Number: 603-RC0603FR-071ML; Mouser Price/Stock: https://www.mouser.co.uk/ProductDetail/Yageo/RC0603FR-071ML/?qs=VU8sRB4EgwDPceeQKB324w%3D%3D; Arrow Part Number: RC0603FR-071ML; Arrow Price/Stock: https://www.arrow.com/en/products/rc0603fr-071ml/yageo
R301 R302 = WSK1216L5000FEA: Resistor; Manufacturer_Name: Vishay; Datasheet Link: http://www.vishay.com/docs/30189/wsk1216.pdf; Height: 1.9mm; Manufacturer_Part_Number: WSK1216L5000FEA
R303 R304 = RC0603FR-0710KL: as R100 on sheet modFOC-Motion_Controller; Datasheet Link: http://www.yageo.com/documents/recent/PYu-RC0603_51_RoHS_L_v5.pdf; Height: 0.55mm; Manufacturer_Part_Number: RC0603FR-0710KL; Arrow Part Number: RC0603FR-0710KL; Arrow Price/Stock: https://www.arrow.com/en/products/rc0603fr-0710kl/yageo; Mouser Part Number: 603-RC0603FR-0710KL; Mouser Price/Stock: https://www.mouser.co.uk/ProductDetail/Yageo/RC0603FR-0710KL?qs=grNVn54RoB%252B3GtjbJj3wJQ%3D%3D
R305 R306 = CRCW0603100RFKEAC: Resistor; Manufacturer_Name: Vishay; Datasheet Link: https://componentsearchengine.com/Datasheets/1/CRCW0603100RFKEAC.pdf; Height: 0.55mm; Manufacturer_Part_Number: CRCW0603100RFKEAC; Mouser Part Number: 71-CRCW0603100RFKEAC; Mouser Price/Stock: https://www.mouser.co.uk/ProductDetail/Vishay-Dale/CRCW0603100RFKEAC/?qs=E3Y5ESvWgWPJqb4%2F19sAKw%3D%3D; Arrow Part Number: CRCW0603100RFKEAC; Arrow Price/Stock: https://www.arrow.com/en/products/crcw0603100rfkeac/vishay
R307 = RC0603FR-10470RL: Resistor; Manufacturer_Name: YAGEO (PHYCOMP); Datasheet Link: http://www.yageo.com/documents/recent/PYu-RC0603_51_RoHS_L_v5.pdf; Height: 0.55mm; Manufacturer_Part_Number: RC0603FR-10470RL; Mouser Part Number: 603-RC0603FR-10470RL; Mouser Price/Stock: https://www.mouser.co.uk/ProductDetail/Yageo/RC0603FR-10470RL?qs=EiqXWrxQq62gi8HBTlzDog%3D%3D
SW300 SW301 = LL3301AF065QJ: Switch; Manufacturer_Name: E-Switch; Datasheet Link: https://media.digikey.com/pdf/Data%20Sheets/E-Switch%20PDFs/LL3301AF065QJ.pdf; Height: 7.3mm; Manufacturer_Part_Number: LL3301AF065QJ; Mouser Part Number: 612-LL3301AF065QJ; Mouser Price/Stock: https://www.mouser.co.uk/ProductDetail/E-Switch/LL3301AF065QJ?qs=QtyuwXswaQi68RkbBY57jQ%3D%3D

## Nets that join several sheets
3V3: modFOC-Motion_Controller (24 pins), modFOC-Sensing (R204.2), modFOC-Powerstage (R304.2)
+5: modFOC-Motion_Controller (5 pins), modFOC-Sensing (9 pins), modFOC-Powerstage (C308.2 IC300.24)
GND: modFOC-Motion_Controller (39 pins), modFOC-Sensing (18 pins), modFOC-Powerstage (31 pins)
VB+: modFOC-Sensing (R212.2), modFOC-Powerstage (29 pins)
NetC204_2: modFOC-Motion_Controller (IC_101.16), modFOC-Sensing (C204.2 R209.1)
NetC205_2: modFOC-Motion_Controller (IC_101.20 IC_101.74), modFOC-Sensing (C205.2 D200.3 R212.1 R213.2)
NetC206_2: modFOC-Motion_Controller (IC_101.18), modFOC-Sensing (C206.2 R214.1)
NetIC200_2: modFOC-Motion_Controller (IC_101.38), modFOC-Sensing (IC200.2)
NetIC200_5: modFOC-Motion_Controller (IC_101.37), modFOC-Sensing (IC200.5)
NetIC200_7: modFOC-Motion_Controller (IC_101.36), modFOC-Sensing (IC200.7)
NetIC300_22: modFOC-Sensing (R214.2), modFOC-Powerstage (IC300.22)
NetIC300_23: modFOC-Sensing (R209.2), modFOC-Powerstage (IC300.23)
NetIC300_34: modFOC-Motion_Controller (IC_101.46), modFOC-Powerstage (IC300.34)
NetIC300_35: modFOC-Motion_Controller (IC_101.47), modFOC-Powerstage (IC300.35)
NetIC300_36: modFOC-Motion_Controller (IC_101.41), modFOC-Powerstage (IC300.36)
NetIC300_37: modFOC-Motion_Controller (IC_101.42), modFOC-Powerstage (IC300.37)
NetIC300_38: modFOC-Motion_Controller (IC_101.39), modFOC-Powerstage (IC300.38)
NetIC300_39: modFOC-Motion_Controller (IC_101.40), modFOC-Powerstage (IC300.39)
NetIC_101_12: modFOC-Motion_Controller (IC_101.12), modFOC-Sensing (R203.2)
NetIC_101_17: modFOC-Motion_Controller (IC_101.17), modFOC-Sensing (R210.1 R215.2)
NetIC_101_19: modFOC-Motion_Controller (IC_101.19), modFOC-Sensing (R211.1 R216.2)
NetIC_101_32: modFOC-Motion_Controller (IC_101.32), modFOC-Powerstage (R303.2)